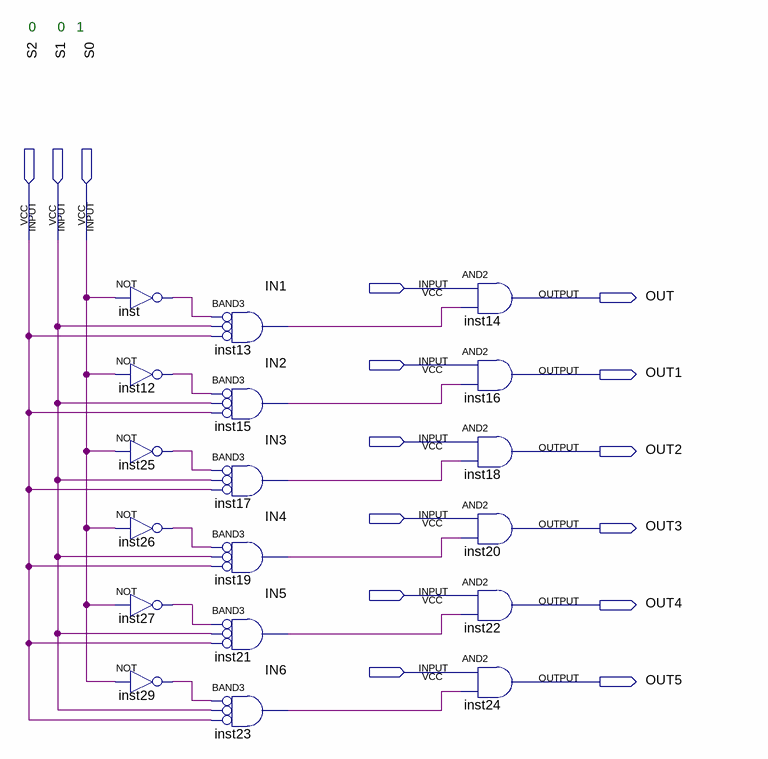
[diagram p0: schematic sheet]
// Quartus schematic DecoderSubtracao.bdf as structural Verilog: 18 symbols, 15 pins
module DecoderSubtracao (
  input  S2,
  input  S1,
  input  S0,
  input  IN1,
  input  IN2,
  input  IN3,
  input  IN4,
  input  IN5,
  input  IN6,
  output OUT,
  output OUT1,
  output OUT2,
  output OUT3,
  output OUT4,
  output OUT5
);

  wire inst12_out, inst13_out, inst15_out, inst17_out, inst19_out, inst21_out, inst23_out, inst25_out,
       inst26_out, inst27_out, inst29_out, inst_out;

  not inst (inst_out, S0);
  not inst12 (inst12_out, S0);
  not inst25 (inst25_out, S0);
  not inst26 (inst26_out, S0);
  not inst27 (inst27_out, S0);
  not inst29 (inst29_out, S0);
  and inst13 (inst13_out, ~inst_out, ~S1, ~S2);  // BAND3
  and inst15 (inst15_out, ~inst12_out, ~S1, ~S2);  // BAND3
  and inst17 (inst17_out, ~inst25_out, ~S1, ~S2);  // BAND3
  and inst19 (inst19_out, ~inst26_out, ~S1, ~S2);  // BAND3
  and inst21 (inst21_out, ~inst27_out, ~S1, ~S2);  // BAND3
  and inst23 (inst23_out, ~inst29_out, ~S1, ~S2);  // BAND3
  and inst14 (OUT, IN1, inst13_out);
  and inst16 (OUT1, IN2, inst15_out);
  and inst18 (OUT2, IN3, inst17_out);
  and inst20 (OUT3, IN4, inst19_out);
  and inst22 (OUT4, IN5, inst21_out);
  and inst24 (OUT5, IN6, inst23_out);

  // Notes on the sheet:
  //   0
  //   0
  //   1
endmodule
